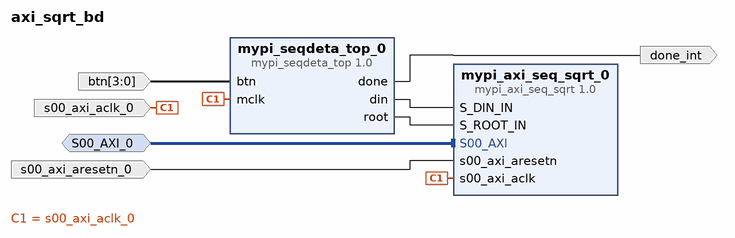
[diagram p0: block diagram of the top level]
# Vivado block design axi_sqrt_bd, xc7z020clg400-1, Vivado 2022.1
create_bd_design axi_sqrt_bd

create_bd_intf_port -mode Slave -vlnv xilinx.com:interface:aximm_rtl:1.0 S00_AXI_0
set_property -dict [list \
  CONFIG.ADDR_WIDTH 16 \
  CONFIG.ARUSER_WIDTH 0 \
  CONFIG.AWUSER_WIDTH 0 \
  CONFIG.BUSER_WIDTH 0 \
  CONFIG.DATA_WIDTH 32 \
  CONFIG.HAS_BRESP 1 \
  CONFIG.HAS_BURST 0 \
  CONFIG.HAS_CACHE 0 \
  CONFIG.HAS_LOCK 0 \
  CONFIG.HAS_PROT 1 \
  CONFIG.HAS_QOS 0 \
  CONFIG.HAS_REGION 0 \
  CONFIG.HAS_RRESP 1 \
  CONFIG.HAS_WSTRB 1 \
  CONFIG.ID_WIDTH 0 \
  CONFIG.MAX_BURST_LENGTH 1 \
  CONFIG.NUM_READ_OUTSTANDING 1 \
  CONFIG.NUM_READ_THREADS 1 \
  CONFIG.NUM_WRITE_OUTSTANDING 1 \
  CONFIG.NUM_WRITE_THREADS 1 \
  CONFIG.PROTOCOL AXI4LITE \
  CONFIG.READ_WRITE_MODE READ_WRITE \
  CONFIG.RUSER_BITS_PER_BYTE 0 \
  CONFIG.RUSER_WIDTH 0 \
  CONFIG.SUPPORTS_NARROW_BURST 0 \
  CONFIG.WUSER_BITS_PER_BYTE 0 \
  CONFIG.WUSER_WIDTH 0 \
] [get_bd_intf_ports S00_AXI_0]
create_bd_port -dir I -from 3 -to 0 btn
create_bd_port -dir I -type clk s00_axi_aclk_0
create_bd_port -dir O done_int
create_bd_port -dir I -type rst s00_axi_aresetn_0

create_bd_cell -type ip -vlnv xilinx.com:user:mypi_axi_seq_sqrt:1.0 mypi_axi_seq_sqrt_0
create_bd_cell -type ip -vlnv xilinx.com:user:mypi_seqdeta_top:1.0 mypi_seqdeta_top_0

# ---- connections ----

connect_bd_intf_net -intf_net S00_AXI_0_1 [get_bd_intf_ports S00_AXI_0] [get_bd_intf_pins mypi_axi_seq_sqrt_0/S00_AXI]
connect_bd_net -net btn_0_1 [get_bd_ports btn] [get_bd_pins mypi_seqdeta_top_0/btn]
connect_bd_net [get_bd_pins mypi_seqdeta_top_0/din] [get_bd_pins mypi_axi_seq_sqrt_0/S_DIN_IN]
connect_bd_net [get_bd_pins mypi_seqdeta_top_0/done] [get_bd_ports done_int]
connect_bd_net [get_bd_pins mypi_seqdeta_top_0/root] [get_bd_pins mypi_axi_seq_sqrt_0/S_ROOT_IN]
connect_bd_net -net s00_axi_aclk_0_1 [get_bd_ports s00_axi_aclk_0] \
  [get_bd_pins mypi_axi_seq_sqrt_0/s00_axi_aclk] [get_bd_pins mypi_seqdeta_top_0/mclk]
connect_bd_net -net s00_axi_aresetn_0_1 [get_bd_ports s00_axi_aresetn_0] [get_bd_pins mypi_axi_seq_sqrt_0/s00_axi_aresetn]

# ---- address map ----
assign_bd_address -offset 0x0000 -range 4K -target_address_space [get_bd_addr_spaces S00_AXI_0] [get_bd_addr_segs mypi_axi_seq_sqrt_0/S00_AXI/S00_AXI_reg]

validate_bd_design
save_bd_design
